# Altium schematic sheet microController.SchDoc
size A4; SheetNumber: 5; SheetTotal: 7
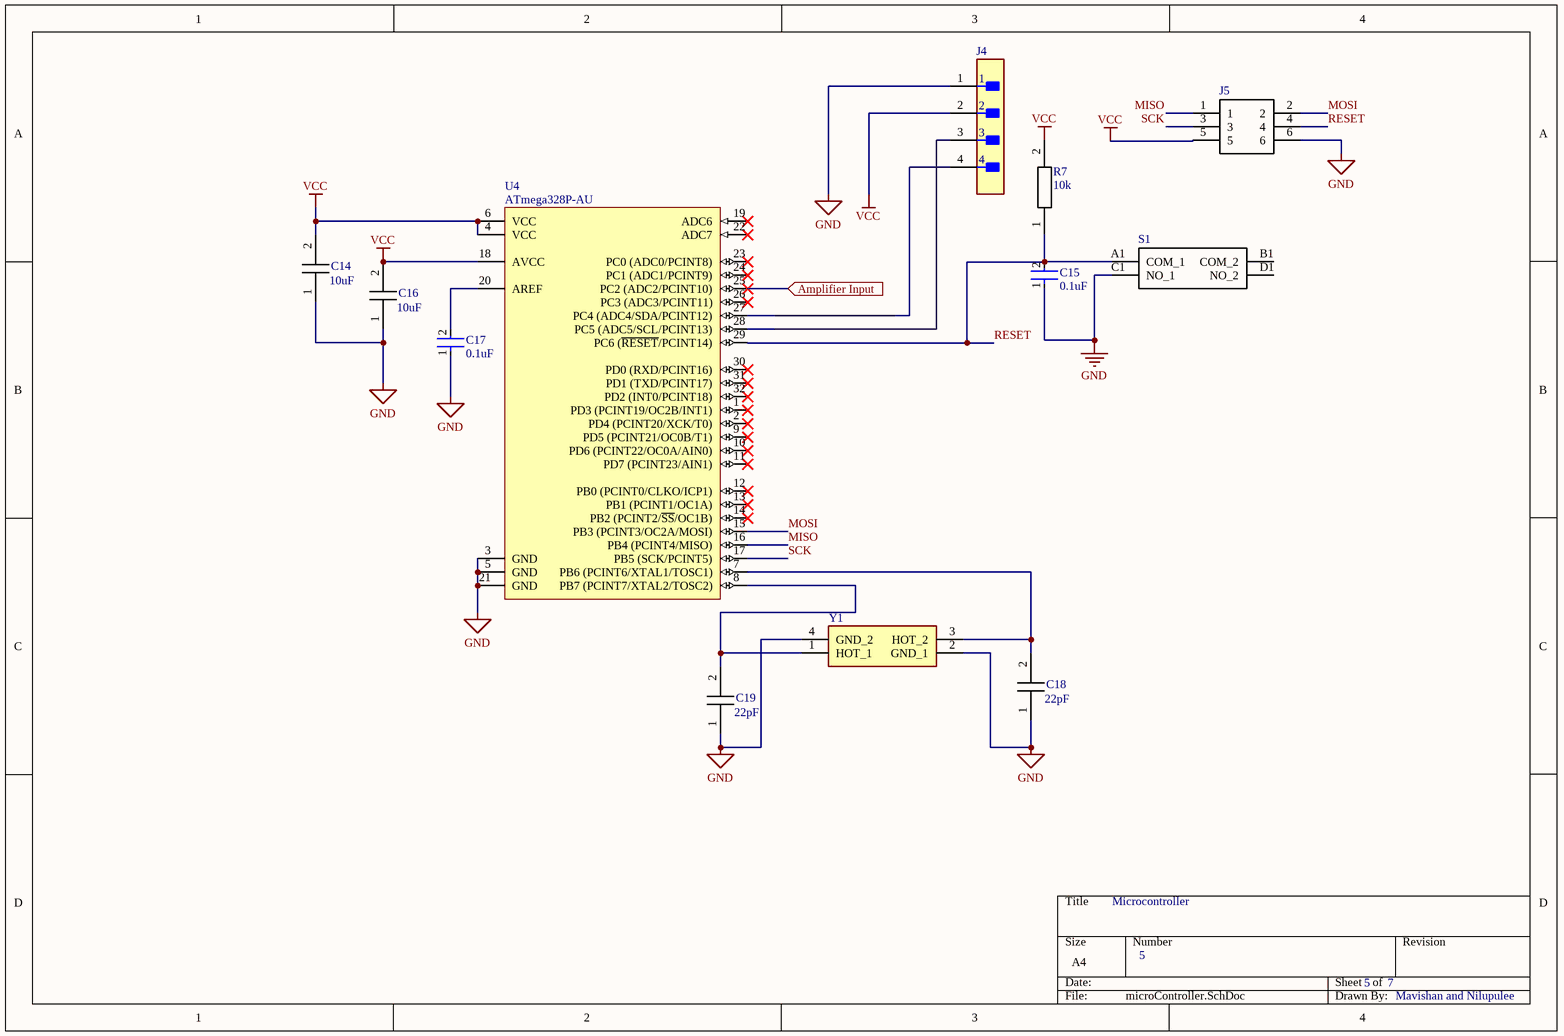
[diagram p0: microController.SchDoc]

## Parts
C14  Parameter 2: 10uF  [CAPC3216X190N]  (hidden comment: CGA5L1X7R1C106K160AC)
C15  0.1uF  [FP-C1206C-EB-MFG]
C16  Parameter 1: 10uF  [CAPC3216X190N]  (hidden comment: CGA5L1X7R1C106K160AC)
C17  0.1uF  [FP-C1206C-EB-MFG]
C18  Parameter 1: 22pF  [CAPC3216X94N]  (hidden comment: 12063A220JAT2A)
C19  Parameter 1: 22pF  [CAPC3216X94N]  (hidden comment: 12063A220JAT2A)
J4  B4B-XH-A(LF)(SN)  [FP-B4B-XH-A_LF_SN-MFG]  (value not drawn)
J5  87914-0606  [HDRV6W69P254_2X3_762X498X859P]  (value not drawn)
R7  Parameter 1: 10k  [RESC3216X70N]  (hidden comment: ERA-8AEB103V)
S1  TS-1187A-B-A-B  [TS1187ABAB]  (value not drawn)
U4  ATmega328P-AU  [32A_M]
Y1  CX3225SA40000D0PTWCC  [CX3225SA40000D0PTWCC]  (value not drawn)

## Ports
Amplifier Input (in, see Main PCB[3C])

## Nets
GND: C14.1 C15.1 C16.1 C17.1 C18.1(C1) C19.1(C1) J4.1 J5.6 S1.C1(NO_1) U4.3(GND) U4.5(GND) U4.21(GND) Y1.2(GND_1) Y1.4(GND_2)
VCC: C14.2 C16.2 J4.2 J5.5 R7.2 U4.4(VCC) U4.6(VCC) U4.18(AVCC)
Amplifier Input: U4.25(PC2_(ADC2/PCINT10)) ; port Amplifier Input
MISO: J5.1 U4.16(PB4_(PCINT4/MISO))
MOSI: J5.2 U4.15(PB3_(PCINT3/OC2A/MOSI))
RESET: C15.2 J5.4 R7.1 S1.A1(COM_1) U4.29(PC6_(~{RESET}/PCINT14))
SCK: J5.3 U4.17(PB5_(SCK/PCINT5))
NetC17_2: C17.2 U4.20(AREF)
NetC18_2: C18.2(C2) U4.7(PB6_(PCINT6/XTAL1/TOSC1)) Y1.3(HOT_2)
NetC19_2: C19.2(C2) U4.8(PB7_(PCINT7/XTAL2/TOSC2)) Y1.1(HOT_1)
NetJ4_3: J4.3 U4.28(PC5_(ADC5/SCL/PCINT13))
NetJ4_4: J4.4 U4.27(PC4_(ADC4/SDA/PCINT12))

Not connected (* = marked no-connect by the designer): S1 B1(COM_2) D1(NO_2); U4 1(PD3_(PCINT19/OC2B/INT1))* 2(PD4_(PCINT20/XCK/T0))* 9(PD5_(PCINT21/OC0B/T1))* 10(PD6_(PCINT22/OC0A/AIN0))* 11(PD7_(PCINT23/AIN1))* 12(PB0_(PCINT0/CLKO/ICP1))* 13(PB1_(PCINT1/OC1A))* 14(PB2_(PCINT2/~{SS}/OC1B))* 19(ADC6)* 22(ADC7)* 23(PC0_(ADC0/PCINT8))* 24(PC1_(ADC1/PCINT9))* 26(PC3_(ADC3/PCINT11))* 30(PD0_(RXD/PCINT16))* 31(PD1_(TXD/PCINT17))* 32(PD2_(INT0/PCINT18))*

## Notes on the sheet
- Microcontroller
- 5
- 7
- Mavishan and Nilupulee

## Library data of the parts
C14 C16 = CGA5L1X7R1C106K160AC: Capacitor; Manufacturer_Name: TDK; Datasheet Link: http://docs-europe.electrocomponents.com/webdocs/14e9/0900766b814e9125.pdf; Height: 1.9mm; Manufacturer_Part_Number: CGA5L1X7R1C106K160AC; Mouser Part Number: 810-CGA5L1X7R1C106KC; Mouser Price/Stock: https://www.mouser.co.uk/ProductDetail/TDK/CGA5L1X7R1C106K160AC?qs=xLDY6iXSiQYs%2FbZYg2RcKQ%3D%3D; Arrow Part Number: CGA5L1X7R1C106K160AC; Arrow Price/Stock: https://www.arrow.com/en/products/cga5l1x7r1c106k160ac/tdk
C15 C17 = CMP-1037-04186-2: CAP CER 0.1UF 25V C0G/NP0 1206; Manufacturer: KEMET; Manufacturer Part Number: C1206C104F3GACTU; Material: Ceramic; Value: 0.10 μF; Temperature Characteristic: C0G; Temperature Coefficient: 15%; Tolerance: 0.01; Automotive Grade: Grade 0; Device Class L3: Ceramic Capacitors; Voltage Rating: 25 V; Temperature Range Low: -55°C; RoHS: TRUE; Package: C1206C-EB; Category: Cap; Lead Free: Yes; ComponentLink2URL: https://content.kemet.com/datasheets/KEM_C1007_X8R_ULTRA_150C_SMD.pdf; Ipc Land Pattern Name: CAPC320160X78; Temperature Range High: +150°C; Height: 0.88mm; Digikey Description: CAP CER 0.1UF 25V C0G/NP0 1206; ComponentLink2Description: Datasheet; Capacitance: 0.10 μF; Mouser Description: Multilayer Ceramic Capacitors MLCC - SMD/SMT 25volts 0.1uF 1% C0G; Octopart: https://octopart.com/c1206c104f3gactu-kemet-13149870; Device Class L1: Passive Components; Device Class L2: Capacitors; Automotive: Yes; Temperature: -55°C to +150°C
C18 C19 = 12063A220JAT2A: Capacitor; Manufacturer_Name: Kyocera AVX; Manufacturer_Part_Number: 12063A220JAT2A; Mouser Part Number: 581-12063A220JAT2A; Mouser Price/Stock: https://www.mouser.com/Search/Refine.aspx?Keyword=581-12063A220JAT2A; Arrow Part Number: 12063A220JAT2A; Arrow Price/Stock: https://www.arrow.com/en/products/12063a220jat2a/avx
J4 = CMP-17439-000250-1: CONN HEADER VERT 4POS 2.5MM; Number of Contacts: 4; Contact Resistance: 20mR; Voltage Rating: 250V; Max Current Rating: 3A; Gender: Male; Wire/Cable Gauge: 22AWG; Mated Stacking Heights: 9.8mm; Insulation Resistance: 1GR; Orientation: Straight; Contact Type: Male Pin; Contact Finish - Mating: TIN; Series: XH; Max Voltage Rating (AC): 250V; Lead Pitch: 2.5mm; Contact Shape: Square; Insulation Color: Natural; Termination: Solder; Lead Free: Lead Free; Voltage Rating (AC): 250V; Number of Rows: 1; Flammability Rating: UL94 V-0; Number of Positions: 4; Max Operating Temperature: 85°C; Package Quantity: 500; Mount: Through Hole; REACH SVHC: No SVHC; Connector Type: Header; Insulation Material: Nylon; Fastening Type: Detent; Min Operating Temperature: -25°C; Housing Color: White; Packaging: Bulk; Contact Plating: Tin; Contact Material: Brass; Max Voltage Rating (DC): 250V; Housing Material: Polyamide; Color: Natural; Material: Polyamide; Pitch: 2.5mm; Depth: 5.75mm; Current Rating: 3A; Length: 12.4mm
J5 = 87914-0606: Connector; Manufacturer_Name: Molex; Datasheet Link: https://www.molex.com/content/dam/molex/molex-dot-com/products/automated/en-us/salesdrawingpdf/879/87914/879140606_sd.pdf; Height: 8.59mm; Manufacturer_Part_Number: 87914-0606; Mouser Part Number: 538-87914-0606; Mouser Price/Stock: https://www.mouser.co.uk/ProductDetail/Molex/87914-0606?qs=y2iaK3rfSTnIsAUr2bgTSw%3D%3D
R7 = ERA-8AEB103V: Resistor; Manufacturer_Name: Panasonic; Datasheet Link: https://industrial.panasonic.com/cdbs/www-data/pdf/RDM0000/AOA0000C307.pdf; Height: 0.7mm; Manufacturer_Part_Number: ERA-8AEB103V; Mouser Part Number: 667-ERA-8AEB103V; Mouser Price/Stock: https://www.mouser.co.uk/ProductDetail/Panasonic/ERA-8AEB103V?qs=Ojoo2rCVP9QscDrGu5R0Gw%3D%3D; Arrow Part Number: ERA-8AEB103V; Arrow Price/Stock: https://www.arrow.com/en/products/era8aeb103v/panasonic?region=europe
S1 = TS-1187A-B-A-B: Switch; Manufacturer_Name: XKB Connectivity; Datasheet Link: http://www.helloxkb.com/public/images/pdf/TS-1187A-X-X-X.pdf; Height: 4.05mm; Manufacturer_Part_Number: TS-1187A-B-A-B
U4 = CMP-0095-00269-2: 8-bit AVR Microcontroller, 32KB Flash, 1KB EEPROM, 2KB SRAM, 32-pin TQFP, Industrial Grade (-40°C to 85°C); PackageDescription: 32-Lead, 7x7x1.0 mm Body, 0.8mm Lead Pitch, Thin Profile Plastic Quad Flat Package (TQFP); DatasheetVersion: revD, May-2011; RevisionNote: DatasheetVersion & PackageVersion updated. URLs added.; ComponentLink1URL: http://www.atmel.com/; ComponentLink2Description: ATmega48A/48PA/88A/88PA/168A/168PA/328/328P Datasheet; Code_JEDEC: MS-026-ABA; ComponentLink1Description: Manufacturer URL; PackageReference: 32A; ComponentLink3Description: ATmega48A/48PA/88A/88PA/168A/168PA/328/328P Summary; ComponentLink2URL: http://www.atmel.com/dyn/resources/prod_documents/doc8271.pdf; PackageVersion: revC, Oct-2010; ComponentLink3URL: http://www.atmel.com/dyn/resources/prod_documents/8271S.pdf
Y1 = CX3225SA40000D0PTWCC: Crystal or Oscillator; Manufacturer_Name: KYOCERA; Datasheet Link: https://media.digikey.com/pdf/Data%20Sheets/Kyocera%20International/CX3225SA40000D0PTWCC_DS.pdf; Height: 0.8mm; Manufacturer_Part_Number: CX3225SA40000D0PTWCC; Mouser Part Number: 581-CX3225SA40D0PTWC; Mouser Price/Stock: https://www.mouser.co.uk/ProductDetail/KYOCERA-AVX/CX3225SA40000D0PTWCC?qs=HuCFcgRyUKhyUGYK%2FnO9Bw%3D%3D; Arrow Part Number: CX3225SA40000D0PTWCC; Arrow Price/Stock: https://www.arrow.com/en/products/cx3225sa40000d0ptwcc/kyocera